# EAGLE design WeatherMoon (EAGLE 9.6.2)
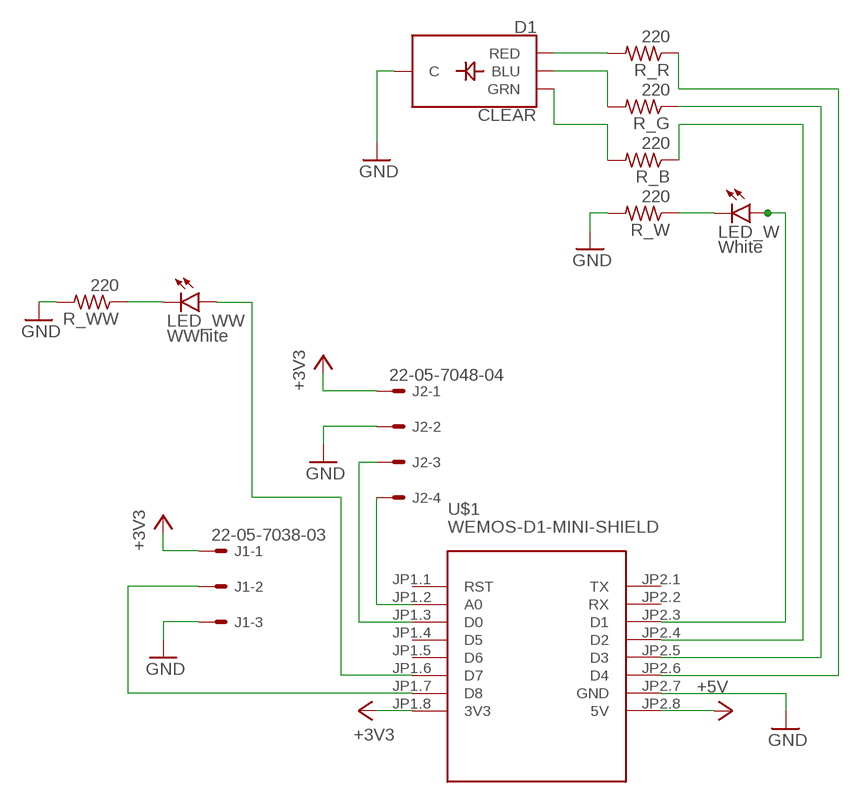
[diagram p0: schematic, sheet 1]

## Parts
D1  CLEAR  LED-RGB-CCCLEAR  [LED-RGB-THRU]
J1  22-05-7038-03  [7395-03]
J2  22-05-7048-04  [7395-04]
LED_W  White  LED5MM  [LED5MM]
LED_WW  WWhite  LED5MM  [LED5MM]
R_B  220  R-US_0204/7  [0204/7]
R_G  220  R-US_0204/7  [0204/7]
R_R  220  R-US_0204/7  [0204/7]
R_W  220  R-US_0204/7  [0204/7]
R_WW  220  R-US_0204/7  [0204/7]
U$1  WEMOS-D1-MINI-SHIELD  [WEMOS-D1-MINI-SHIELD]

## Nets
+3V3: J1.1 J2.1 U$1.JP1.8(3V3)
+5V: U$1.JP2.8(5V)
GND: D1.2(C) J1.3 J2.2 R_W.2 R_WW.2 U$1.JP2.7(GND)
N$1: R_R.1 U$1.JP2.6(D4)
N$2: R_G.1 U$1.JP2.5(D3)
N$3: R_B.1 U$1.JP2.4(D2)
N$4: LED_W.A U$1.JP2.3(D1)
N$5: LED_W.K(C) R_W.1
N$6: D1.1(RED) R_R.2
N$7: D1.4(BLU) R_G.2
N$8: D1.3(GRN) R_B.2
N$9: LED_WW.A U$1.JP1.6(D7)
N$10: J1.2 U$1.JP1.7(D8)
N$11: LED_WW.K(C) R_WW.1
N$12: J2.4 U$1.JP1.2(A0)
N$13: J2.3 U$1.JP1.3(D0)
Unconnected: U$1.JP1.1(RST) U$1.JP1.4(D5) U$1.JP1.5(D6) U$1.JP2.1(TX) U$1.JP2.2(RX)

## Library data of the parts
D1 = SparkFun-LED:LED-RGB-CC: LED-RGB Common Cathode Packages: LED RGB-THRU LED_PIRANHA_5MM SparkFun Products: RGB Diffused Common Cathode- Diffuse <[https://www.sparkfun.com/products/9264]> RGB Diffused Common Cathode - Clear <[https://www.sparkfun.com/products/105]> LED-RGB 5mm Square (Piranha) <[https://www.sparkfun.com/products/11679]>; PROD_ID: DIO-08418
J1 = con-molex:22-?-03: CONNECTOR wire to board 2.54 mm (.1 inch) pitch header; MF: MOLEX; OC_FARNELL: unknown; OC_NEWARK: unknown
J2 = con-molex:22-?-04: CONNECTOR wire to board 2.54 mm (.1 inch) pitch header; MF: MOLEX; OC_FARNELL: unknown; OC_NEWARK: unknown
LED_W LED_WW = led:LED: LED OSRAM: - CHIPLED LG R971, LG N971, LY N971, LG Q971, LY Q971, LO R971, LY R971 LH N974, LH R974 LS Q976, LO Q976, LY Q976 LO Q996 - Hyper CHIPLED LW Q18S LB Q993, LB Q99A, LB R99A - SideLED LS A670, LO A670, LY A670, LG A670, LP A670 LB A673, LV A673, LT A673, LW A673 LH A674 LY A675 LS A676, LA A676, LO A676, LY A676, LW A676 LS A679, LY A679, LG A679 - Hyper Micro SIDELED® LS Y876, LA Y876, LO Y876, LY Y876 LT Y87S - SmartLED LW L88C, LW L88S LB L89C, LB L89S, LG L890 LS L89K, LO L89K, LY L89K LS L896, LA L896, LO L896, LY L896 - TOPLED LS T670, LO T670, LY T670, LG T670, LP T670 LSG T670, LSP T670, LSY T670, LOP T670, LYG T670 LG T671, LOG T671, LSG T671 LB T673, LV T673, LT T673, LW T673 LH T674 LS T676, LA T676, LO T676, LY T676, LB T676, LH T676, LSB T676, LW T676 LB T67C, LV T67C, LT T67C, LS T67K, LO T67K, LY T67K, LW E67C LS E67B, LA E67B, LO E67B, LY E67B, LB E67C, LV E67C, LT E67C LW T67C LS T679, LY T679, LG T679 LS T770, LO T770, LY T770, LG T770, LP T770 LB T773, LV T773, LT T773, LW T773 LH T774 LS E675, LA E675, LY E675, LS T675 LS T776, LA T776, LO T776, LY T776, LB T776 LHGB T686 LT T68C, LB T68C - Hyper Mini TOPLED® LB M676 - Mini TOPLED Santana® LG M470 LS M47K, LO M47K, LY M47K Source: http://www.osram.convergy.de LUXEON: - LUMILED® LXK2-PW12-R00, LXK2-PW12-S00, LXK2-PW14-U00, LXK2-PW14-V00 LXK2-PM12-R00, LXK2-PM12-S00, LXK2-PM14-U00 LXK2-PE12-Q00, LXK2-PE12-R00, LXK2-PE12-S00, LXK2-PE14-T00, LXK2-PE14-U00 LXK2-PB12-K00, LXK2-PB12-L00, LXK2-PB12-M00, LXK2-PB14-N00, LXK2-PB14-P00, LXK2-PB14-Q00 LXK2-PR12-L00, LXK2-PR12-M00, LXK2-PR14-Q00, LXK2-PR14-R00 LXK2-PD12-Q00, LXK2-PD12-R00, LXK2-PD12-S00 LXK2-PH12-R00, LXK2-PH12-S00 LXK2-PL12-P00, LXK2-PL12-Q00, LXK2-PL12-R00 Source: www.luxeon.com KINGBRIGHT: KA-3528ASYC Source: www.kingbright.com
R_B R_G R_R R_W R_WW = rcl:R-US_: RESISTOR, American symbol; SPICEPREFIX: R
U$1 = diy-modules:WEMOS-D1-MINI-SHIELD: Template for WEMOS D1 mini compatible shields NOTICE: This is a template only. You can use it as a base to create symbols for WEMOS D1 mini compatible shields. Official list of available shields can be found here: https://www.wemos.cc/D1-mini-Shields

## Board
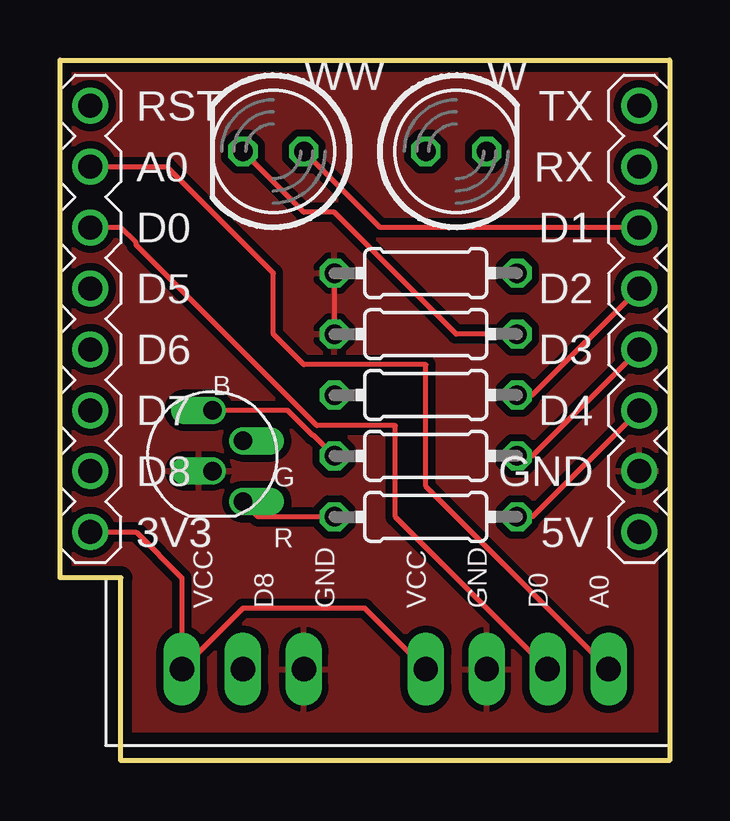
[diagram p1: board, top side]
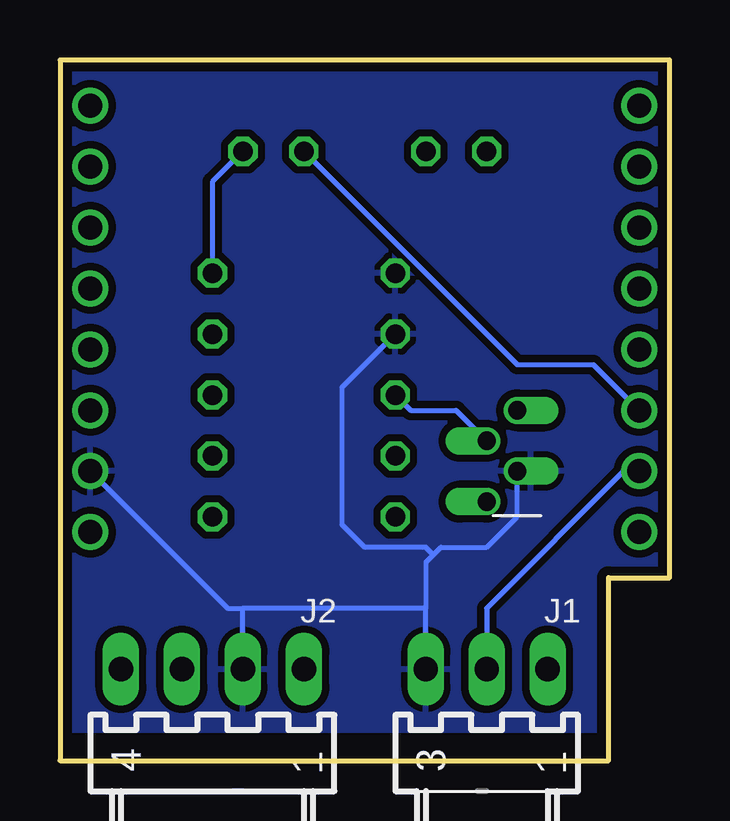
[diagram p2: board, bottom side, seen from below]

Size 25.4 x 29.21 mm. Coordinates in mm from the lower left corner, seen from the top.
Outline: 0,29.21 25.4,29.21 25.4,0 2.54,0 2.54,7.62 0,7.62 0,29.21
Copper layers (1*16): Top 0.035559375mm / dielectric 1.6mm / Bottom 0.035559375mm
Design rules "oshpark-2layer": minimum track width 6mil, minimum drill 10mil, track to track 6mil, track to pad 6mil, pad to pad 6mil, via to via 6mil, smd to smd 6mil, copper to edge 15mil, drill to drill 6mil, minimum pad ring 5mil, minimum via ring 5mil, stop-mask expansion 2.5mil, vias tented up to drill 0mil, thermal gap 10mil

### Footprints (pad centres in the part's own frame; a part is rotated, then mirrored left to right if it is on the bottom)
LED-RGB-THRU = drill 0.762 pad 1.016 offset: 1 1.905,1.27; 2 0.635,0; 3 -0.635,1.27; 4 -1.905,0
7395-03 = drill 1.016 long: 1 2.54,0; 2 0,0; 3 -2.54,0
7395-04 = drill 1.016 long: 1 3.81,0; 2 1.27,0; 3 -1.27,0; 4 -3.81,0
LED5MM = drill 0.813 octagon: A -1.27,0; K 1.27,0
0204/7 = drill 0.813 octagon: 1 -3.81,0; 2 3.81,0
WEMOS-D1-MINI-SHIELD = drill 1: JP1.1 -11.43,12.065; JP1.2 -11.43,9.525; JP1.3 -11.43,6.985; JP1.4 -11.43,4.445; JP1.5 -11.43,1.905; JP1.6 -11.43,-0.635; JP1.7 -11.43,-3.175; JP1.8 -11.43,-5.715; JP2.1 11.43,12.065; JP2.2 11.43,9.525; JP2.3 11.43,6.985; JP2.4 11.43,4.445; JP2.5 11.43,1.905; JP2.6 11.43,-0.635; JP2.7 11.43,-3.175; JP2.8 11.43,-5.715

### Placement (x,y rotation side)
D1  6.35,12.7 270 top
J1  7.62,3.81 0 bottom
J2  19.05,3.81 0 bottom
LED_W  8.89,25.4 180 top
LED_WW  16.51,25.4 0 top
R_B  15.24,15.24 180 top
R_G  15.24,12.7 180 top
R_R  15.24,10.16 180 top
R_W  15.24,17.78 180 top
R_WW  15.24,20.32 180 top
U$1  12.7,15.24 0 top

### Tracks (layer width: path | path; a pad name or v marks a point on that pad's centre or on a via)
+3V3
  Top 0.203: U$1.JP1.8 3.17,9.53 5.08,7.62 J1.1 7.62,6.35 12.7,6.35 J2.1
GND
  Top 0.203: R_WW.2 R_W.2
  Bottom 0.203: 9.84,8.57 9.53,8.89 7.62,8.89 6.35,10.16 D1.2 | 9.84,8.57 10.16,8.89 12.7,8.89 13.65,9.84 13.65,15.56 R_W.2 | J2.2 17.78,6.35 | 17.78,6.35 18.41,6.35 U$1.JP2.7 | J1.3 10.16,6.35 | 10.16,6.35 10.16,8.26 9.84,8.57 | 10.16,6.35 17.78,6.35
  pour Bottom (isolate 0.305): 0,29.21 25.4,29.21 25.4,1.27 2.54,1.27 2.54,7.62 0,7.62
  pour Top (isolate 0.305): 0,29.21 25.4,29.21 25.4,1.27 2.54,1.27 2.54,7.62 0,7.62
N$1
  Top 0.203: U$1.JP2.6 19.69,10.16 R_R.1
N$2
  Top 0.203: U$1.JP2.5 19.69,12.7 R_G.1
N$3
  Top 0.203: U$1.JP2.4 19.69,15.24 R_B.1
N$4
  Top 0.203: U$1.JP2.3 13.33,22.23 LED_W.A
N$5
  Top 0.203: R_W.1 16.51,17.78 11.43,22.86 10.16,22.86 LED_W.K
N$6
  Top 0.203: R_R.2 8.26,10.16 D1.1
N$7
  Top 0.203: R_G.2 10.57,13.56 10.53,13.56 9.49,14.61 D1.4
N$8
  Bottom 0.203: D1.3 8.89,14.61 10.79,14.61 R_B.2
N$9
  Bottom 0.203: U$1.JP1.6 3.17,16.51 6.35,16.51 LED_WW.A
N$10
  Bottom 0.203: U$1.JP1.7 1.9,12.06 7.62,6.35 J1.2
N$11
  Bottom 0.203: R_WW.1 19.05,24.13 LED_WW.K
N$12
  Top 0.203: J2.4 15.24,11.43 15.24,16.51 10.16,16.51 8.89,17.78 8.89,20.32 4.44,24.77 U$1.JP1.2
N$13
  Top 0.203: J2.3 13.97,10.16 13.97,13.97 10.7,13.97 3.17,21.49 3.17,21.59 2.54,22.23 U$1.JP1.3

### Text on the board
tPlace: WW | W | B | G | R | VCC | D8 | GND | VCC | GND | D0 | A0